# EAGLE design BRAINCHIP (EAGLE 6.5.0)
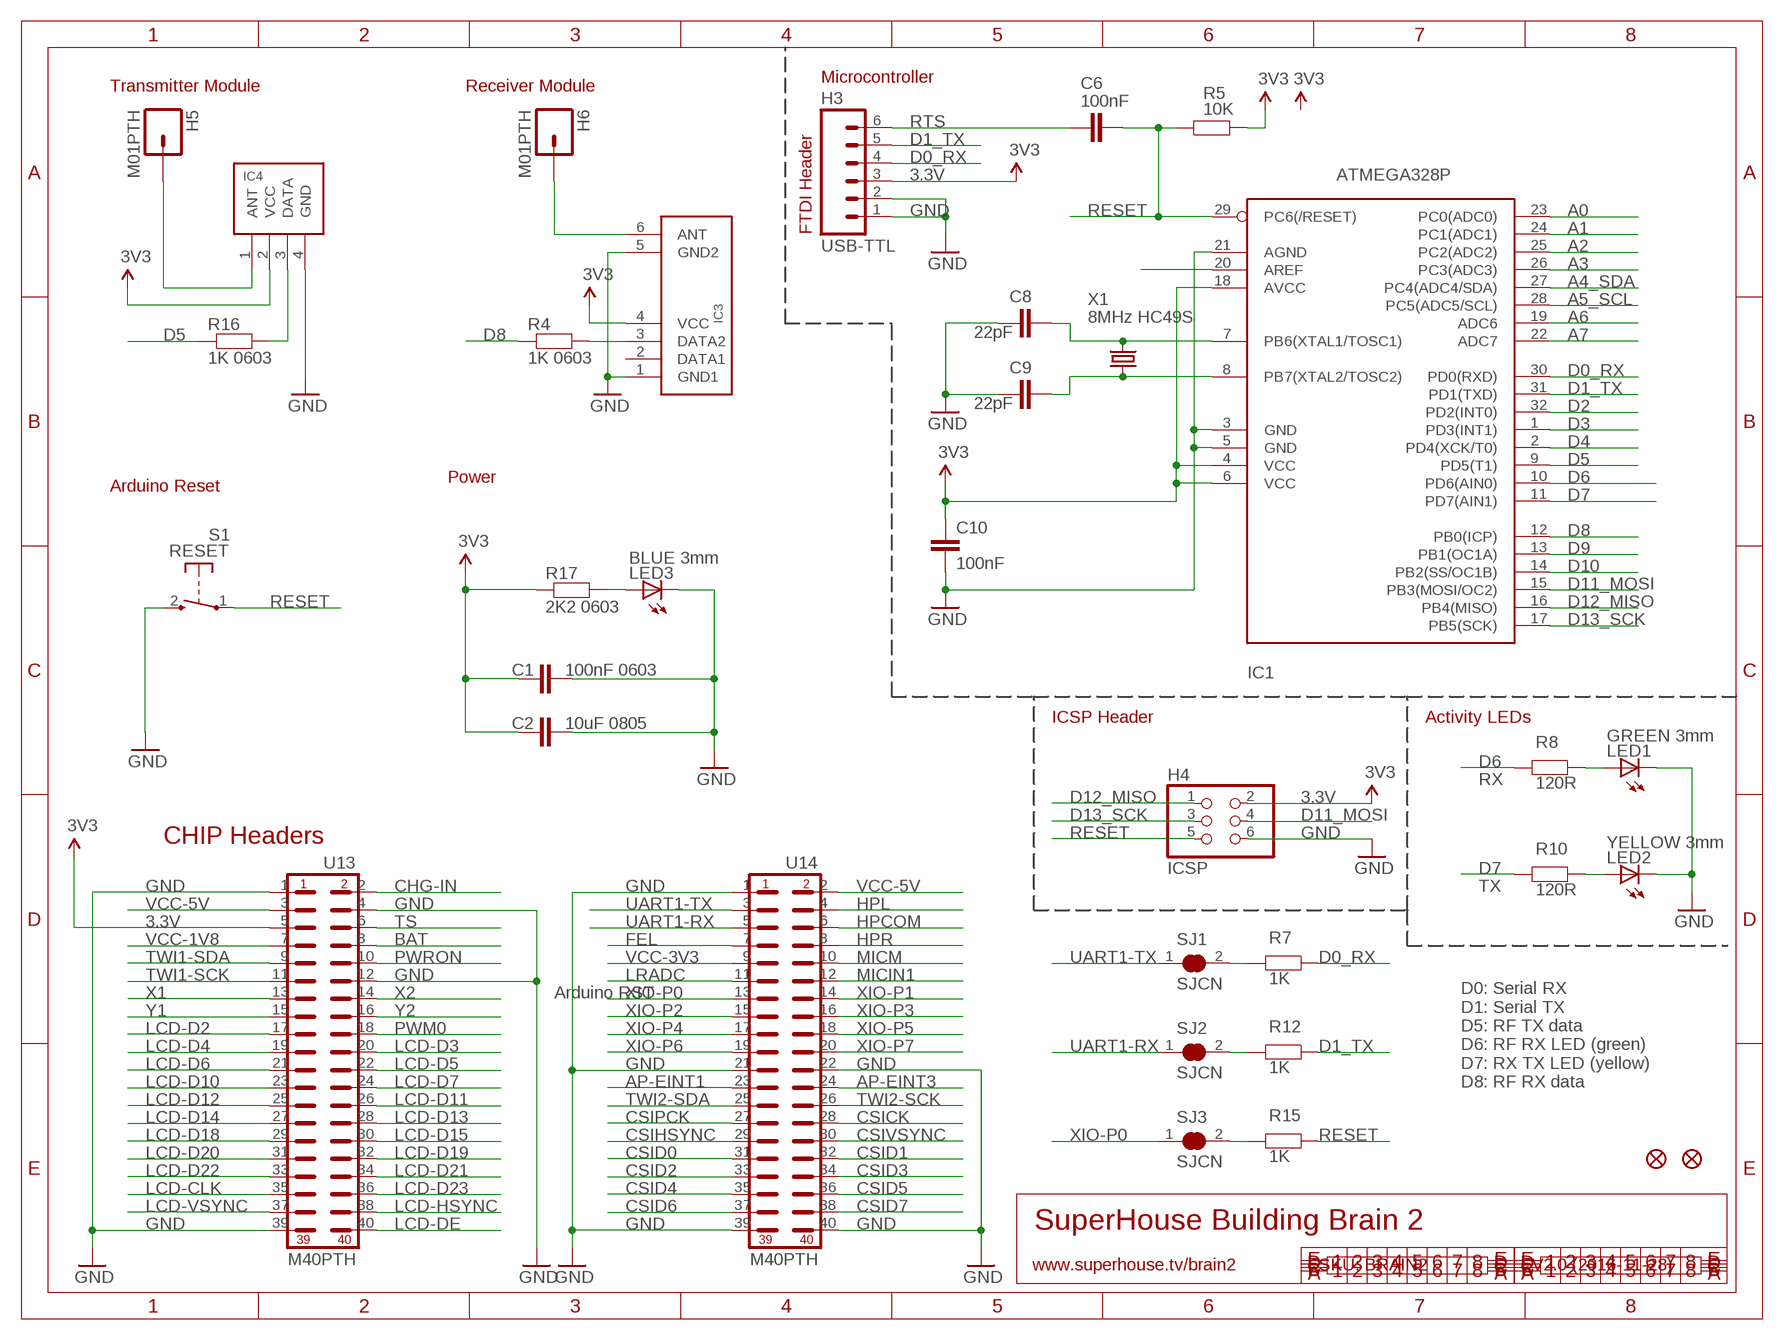
[diagram p0: schematic, sheet 1]

## Parts
C1  100nF 0603  CAP0603  [0603]
C2  10uF 0805  C-EUC0805  [C0805]
C6  100nF  CAP0603  [0603]
C8  22pF  CAP0603  [0603]
C9  22pF  CAP0603  [0603]
C10  100nF  CAP0603  [0603]
H3  USB-TTL  M06SIP  [1X06]
H4  ICSP  PINHD-2X3  [2X03]
H5  M01PTH  [1X01]
H6  M01PTH  [1X01]
IC1  ATMEGA328P  AVR-MEGA8-AI  [TQFP32-08]
IC3  RXB1  RXB1SHORTFLAT  [RX-B1-SHORT-FLAT]
IC4  TX-C1FLAT  [TX-C1-FLAT]
LED1  GREEN 3mm  LED3MM  [LED3MM]
LED2  YELLOW 3mm  LED3MM  [LED3MM]
LED3  BLUE 3mm  LED3MM  [LED3MM]
R4  1K 0603  RESISTOR0603  [0603]
R5  10K  RESISTOR0603  [0603]
R7  1K  RESISTOR0603  [0603]
R8  120R  RESISTOR0603  [0603]
R10  120R  RESISTOR0603  [0603]
R12  1K  RESISTOR0603  [0603]
R15  1K  RESISTOR0603  [0603]
R16  1K 0603  RESISTOR0603  [0603]
R17  2K2 0603  RESISTOR0603  [0603]
S1  RESET  TAC_SWITCH_2PIN  [TACTILE_SWITCH_SMD_2PIN_TINY]
SJ1  SJCN  [SJC]
SJ2  SJCN  [SJC]
SJ3  SJCN  [SJC]
U13  M40PTH  [2X20]
U14  M40PTH  [2X20]
U$5  FIDUCIAL1X2.5  [FIDUCIAL-1X2.5]
U$6  FIDUCIAL1X2.5  [FIDUCIAL-1X2.5]
X1  8MHz HC49S  CRYSTALHC49UV  [HC49U-V]

## Nets
3.3V: C1.1 C2.2 C10.1 H3.3 H4.2 IC1.4(VCC) IC1.6(VCC) IC1.18(AVCC) IC3.4(VCC) IC4.2(VCC) R5.2 R17.1 U13.5 ; supply symbol labelled 3V3
A0: IC1.23(PC0(ADC0))
A1: IC1.24(PC1(ADC1))
A2: IC1.25(PC2(ADC2))
A3: IC1.26(PC3(ADC3))
A4_SDA: IC1.27(PC4(ADC4/SDA))
A5_SCL: IC1.28(PC5(ADC5/SCL))
A6: IC1.19(ADC6)
A7: IC1.22(ADC7)
AP-EINT1: U14.23
AP-EINT3: U14.24
AREF: IC1.20(AREF)
BAT: U13.8
CHG-IN: U13.2
CSICK: U14.28
CSID0: U14.31
CSID1: U14.32
CSID2: U14.33
CSID3: U14.34
CSID4: U14.35
CSID5: U14.36
CSID6: U14.37
CSID7: U14.38
CSIHSYNC: U14.29
CSIPCK: U14.27
CSIVSYNC: U14.30
D0_RX: H3.4 IC1.30(PD0(RXD)) R7.1
D1_TX: H3.5 IC1.31(PD1(TXD)) R12.1
D2: IC1.32(PD2(INT0))
D3: IC1.1(PD3(INT1))
D4: IC1.2(PD4(XCK/T0))
D5: IC1.9(PD5(T1)) R16.1
D6: IC1.10(PD6(AIN0)) R8.2
D7: IC1.11(PD7(AIN1)) R10.2
D8: IC1.12(PB0(ICP)) R4.1
D9: IC1.13(PB1(OC1A))
D10: IC1.14(PB2(SS/OC1B))
D11_MOSI: H4.4 IC1.15(PB3(MOSI/OC2))
D12_MISO: H4.1 IC1.16(PB4(MISO))
D13_SCK: H4.3 IC1.17(PB5(SCK))
FEL: U14.7
GND: C1.2 C2.1 C8.1 C9.1 C10.2 H3.1 H3.2 H4.6 IC1.3(GND) IC1.5(GND) IC1.21(AGND) IC3.1(GND1) IC3.5(GND2) IC4.4(GND) LED1.K(C) LED2.K(C) LED3.K(C) S1.2(S) U13.1 U13.4 U13.12 U13.39 U14.1 U14.21 U14.22 U14.39 U14.40
HPCOM: U14.6
HPL: U14.4
HPR: U14.8
LCD-CLK: U13.35
LCD-D2: U13.17
LCD-D3: U13.20
LCD-D4: U13.19
LCD-D5: U13.22
LCD-D6: U13.21
LCD-D7: U13.24
LCD-D10: U13.23
LCD-D11: U13.26
LCD-D12: U13.25
LCD-D13: U13.28
LCD-D14: U13.27
LCD-D15: U13.30
LCD-D18: U13.29
LCD-D19: U13.32
LCD-D20: U13.31
LCD-D21: U13.34
LCD-D22: U13.33
LCD-D23: U13.36
LCD-DE: U13.40
LCD-HSYNC: U13.38
LCD-VSYNC: U13.37
LRADC: U14.11
MICIN1: U14.12
MICM: U14.10
N$288: IC3.3(DATA2) R4.2
N$289: LED3.A R17.2
N$290: H6.1 IC3.6(ANT)
N$291: H5.1 IC4.1(ANT)
N$292: IC4.3(DATA) R16.2
N$293: C8.2 IC1.7(PB6(XTAL1/TOSC1)) X1.2
N$294: C9.2 IC1.8(PB7(XTAL2/TOSC2)) X1.1
N$295: LED1.A R8.1
N$296: LED2.A R10.1
N$297: R7.2 SJ1.2
N$298: R12.2 SJ2.2
N$299: R15.2 SJ3.2
PWM0: U13.18
PWRON: U13.10
RESET: C6.2 H4.5 IC1.29(PC6(/RESET)) R5.1 R15.1 S1.1(P)
RTS: C6.1 H3.6
TS: U13.6
TWI1-SCK: U13.11
TWI1-SDA: U13.9
TWI2-SCK: U14.26
TWI2-SDA: U14.25
UART1-RX: SJ2.1 U14.5
UART1-TX: SJ1.1 U14.3
VCC-1V8: U13.7
VCC-3V3: U14.9
VCC-5V: U13.3 U14.2
X1: U13.13
X2: U13.14
XIO-P0: SJ3.1 U14.13
XIO-P1: U14.14
XIO-P2: U14.15
XIO-P3: U14.16
XIO-P4: U14.17
XIO-P5: U14.18
XIO-P6: U14.19
XIO-P7: U14.20
Y1: U13.15
Y2: U13.16
Unconnected: IC3.2(DATA1)

## Notes on the sheet
- Microcontroller
- Transmitter Module | Receiver Module
- FTDI Header
- Power
- Arduino Reset
- ICSP Header | Activity LEDs
- RX
- CHIP Headers
- TX
- Arduino RST
- D0: Serial RX
  D1: Serial TX
  D5: RF TX data
  D6: RF RX LED (green)
  D7: RX TX LED (yellow)
  D8: RF RX data
- SuperHouse Building Brain 2
- www.superhouse.tv/brain2 | SKU: BRAIN2 | V2.0 (2016-11-28)

## Library data of the parts
C1 = freetronics:CAP: Capacitor Standard 0603 ceramic capacitor, and 0.1" leaded capacitor.
C2 = freetronics-jon:C-EU: CAPACITOR, European symbol
C6 C8-C10 = freetronics-master-v1.1:CAP: Capacitor Standard 0603 ceramic capacitor, and 0.1" leaded capacitor.
H3 = freetronics:M06: Header 6 Standard 6-pin 0.1" header. Use with straight break away headers (SKU : PRT-00116), right angle break away headers (PRT-00553), swiss pins (PRT-00743), machine pins (PRT-00117), and female headers (PRT-00115). Molex polarized connector foot print use with SKU : PRT-08094 with associated crimp pins and housings. NOTES ON THE VARIANTS LOCK and LOCK_LONGPADS... This footprint was designed to help hold the alignment of a through-hole component (i.e. 6-pin header) while soldering it into place. You may notice that each hole has been shifted either up or down by 0.005 of an inch from it's more standard position (which is a perfectly straight line). This slight alteration caused the pins (the squares in the middle) to touch the edges of the holes. Because they are alternating, it causes a "brace" to hold the component in place. 0.005 has proven to be the perfect amount of "off-center" position when using our standard breakaway headers. Although looks a little odd when you look at the bare footprint, once you have a header in there, the alteration is very hard to notice. Also, if you push a header all the way into place, it is covered up entirely on the bottom side. This idea of altering the position of holes to aid alignment will be further integrated into the Sparkfun Library for other footprints. It can help hold any component with 3 or more connection pins.
H4 = pinhead:PINHD-2X3: PIN HEADER
H5 H6 = freetronics:M01: Header 1 Standard 1-pin 0.1" header. Use with straight break away headers (SKU : PRT-00116), right angle break away headers (PRT-00553), swiss pins (PRT-00743), machine pins (PRT-00117), and female headers (PRT-00115).
IC1 = freetronics-master-v1.1:AVR-MEGA8: MICROCONTROLLER 8 Kbytes FLASH 1 kbytes SRAM 512 bytes EEPROM USART 6-channel 10 bit ADC 2-channel 8 bit ADC
IC3 = freetronics-master-v1:RXB1SHORT
IC4 = freetronics-jon:TX-C1
LED1-LED3 = freetronics-2:LED: LEDs Standard schematic elements and footprints for 5mm, 3mm, 1206, and 0603 sized LEDs. 5mm - Spark Fun Electronics SKU : COM-00529 (and others)
R4 R16 R17 = freetronics-jon:RESISTOR: Resistor Basic schematic elements and footprints for 0603, 1206, and PTH 1/10th watt (small) resistors.
R5 R7 R8 R10 R12 R15 = freetronics-master-v1.1:RESISTOR: Resistor Basic schematic elements and footprints for 0603, 1206, and PTH 1/10th watt (small) resistors.
S1 = freetronics-jon:TAC_SWITCH_2PIN: Momentary Tactile Switch - 2 pin
SJ1-SJ3 = freetronics-jon:SJC
U13 U14 = freetronics-jon:M40
U$5 U$6 = freetronics-original:FIDUCIAL: Fiducial Alignment Points Various fiducial points for machine vision alignment.
X1 = freetronics:CRYSTAL: Crystals Various standard crystals. Proven footprints. Spark Fun Electronics SKU : COM-00534

## Board
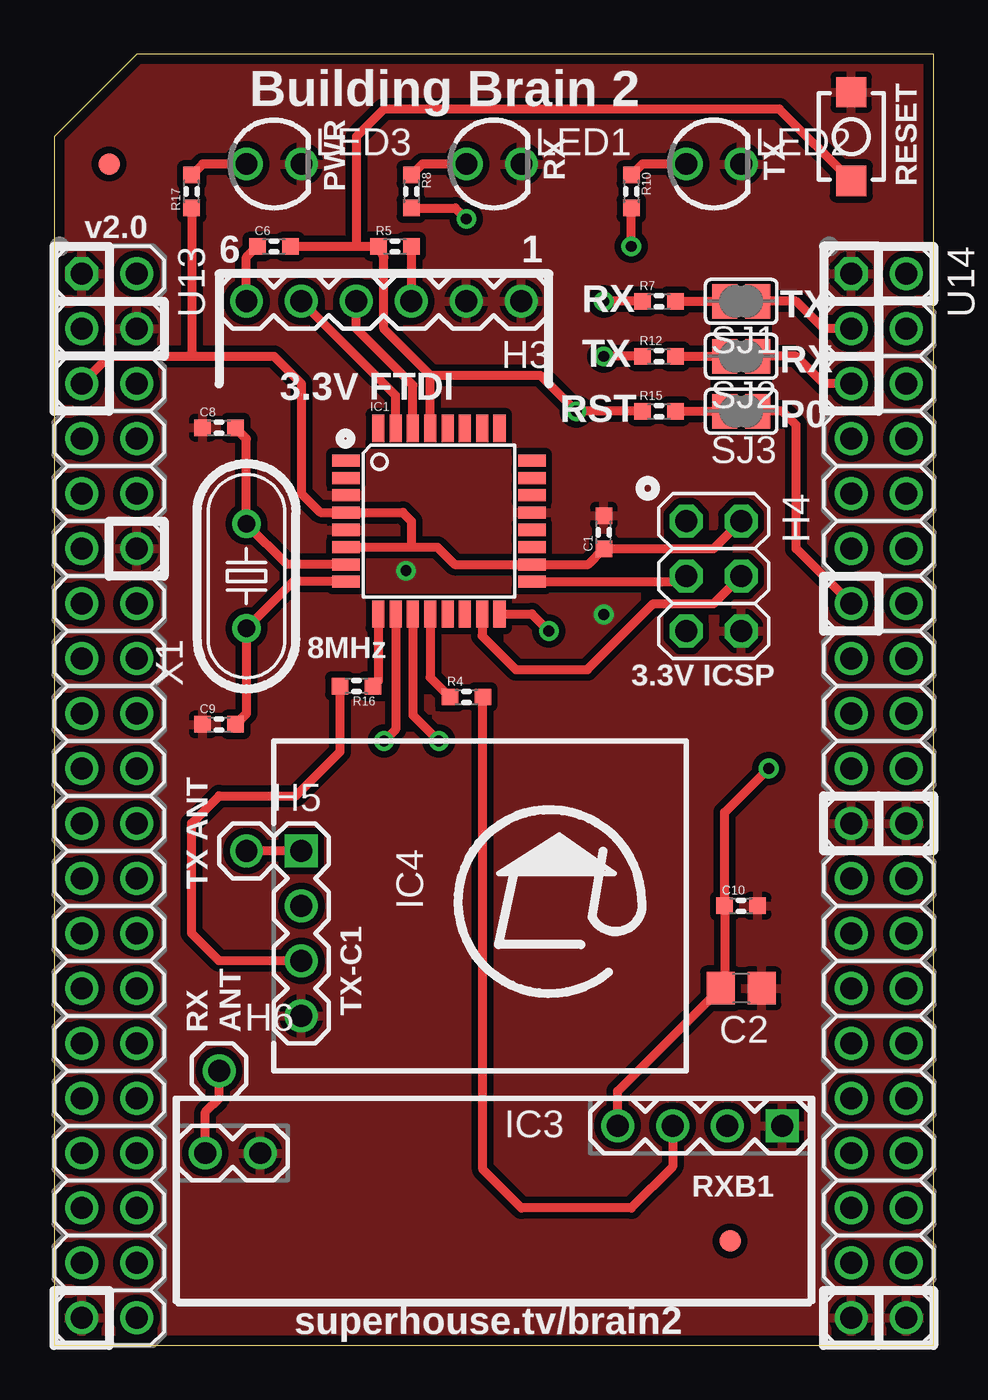
[diagram p1: board, top side]
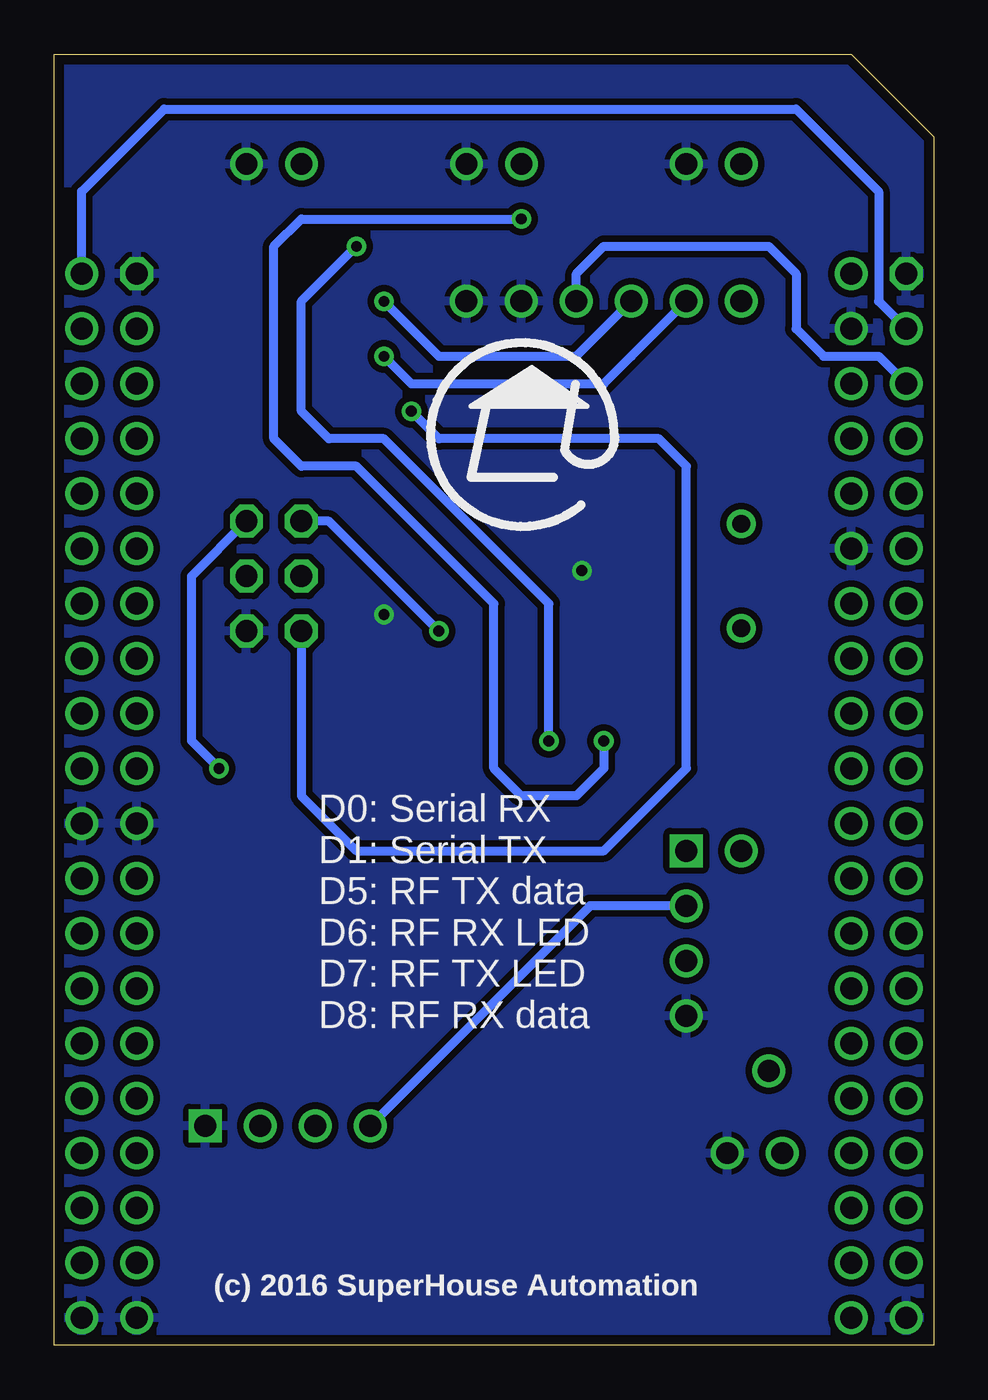
[diagram p2: board, bottom side, seen from below]

Size 40.64 x 59.69 mm. Coordinates in mm from the lower left corner, seen from the top.
Outline: 0,0 40.64,0 40.64,59.69 3.81,59.69 0,55.88 0,0
Copper layers (1*16): Top 0.035mm / dielectric 1.5mm / Bottom 0.035mm
Design rules "default *": minimum track width 10mil, minimum drill 24mil, track to track 12mil, track to pad 12mil, pad to pad 12mil, via to via 12mil, smd to smd 8mil, copper to edge 18mil, drill to drill 8mil, minimum pad ring 10mil, minimum via ring 8mil, stop-mask expansion 4mil, vias tented up to drill 0mil, thermal gap 10mil

### Footprints (pad centres in the part's own frame; a part is rotated, then mirrored left to right if it is on the bottom)
0603 = smd 0.762 x 0.762: 1 -0.762,0; 2 0.762,0
C0805 = smd 1.3 x 1.5: 1 -0.95,0; 2 0.95,0
1X06 = drill 1.016: 1 0,0; 2 2.54,0; 3 5.08,0; 4 7.62,0; 5 10.16,0; 6 12.7,0
2X03 = drill 1.016 octagon: 1 -2.54,-1.27; 2 -2.54,1.27; 3 0,-1.27; 4 0,1.27; 5 2.54,-1.27; 6 2.54,1.27
1X01 = drill 1.016: 1 0,0
TQFP32-08 = smd 1.27 x 0.559: 1 -4.293,2.8; 2 -4.293,2; 3 -4.293,1.2; 4 -4.293,0.4; 5 -4.293,-0.4; 6 -4.293,-1.2; 7 -4.293,-2; 8 -4.293,-2.8; 17 4.293,-2.8; 18 4.293,-2; 19 4.293,-1.2; 20 4.293,-0.4; 21 4.293,0.4; 22 4.293,1.2; 23 4.293,2; 24 4.293,2.8 | smd 0.559 x 1.27: 9 -2.8,-4.293; 10 -2,-4.293; 11 -1.2,-4.293; 12 -0.4,-4.293; 13 0.4,-4.293; 14 1.2,-4.293; 15 2,-4.293; 16 2.8,-4.293; 25 2.8,4.293; 26 2,4.293; 27 1.2,4.293; 28 0.4,4.293; 29 -0.4,4.293; 30 -1.2,4.293; 31 -2,4.293; 32 -2.8,4.293
RX-B1-SHORT-FLAT = drill 1.016 square: 1 0,0 | drill 1.016: 2 2.54,0; 3 5.08,0; 4 7.62,0; 5 24.13,1.27; 6 26.67,1.27
TX-C1-FLAT = drill 1.016 square: 1 0,0 | drill 1.016: 2 2.54,0; 3 5.08,0; 4 7.62,0
LED3MM = drill 1: A -1.27,0; K 1.27,0
TACTILE_SWITCH_SMD_2PIN_TINY = smd 1.4 x 1.4: 1 -2.05,0; 2 2.05,0
SJC = smd 1.168 x 1.6: 1 -0.762,0; 2 0.762,0
2X20 = drill 1.016 octagon: 1 0,0 | drill 1.016: 2 0,2.54; 3 2.54,0; 4 2.54,2.54; 5 5.08,0; 6 5.08,2.54; 7 7.62,0; 8 7.62,2.54; 9 10.16,0; 10 10.16,2.54; 11 12.7,0; 12 12.7,2.54; 13 15.24,0; 14 15.24,2.54; 15 17.78,0; 16 17.78,2.54; 17 20.32,0; 18 20.32,2.54; 19 22.86,0; 20 22.86,2.54; 21 25.4,0; 22 25.4,2.54; 23 27.94,0; 24 27.94,2.54; 25 30.48,0; 26 30.48,2.54; 27 33.02,0; 28 33.02,2.54; 29 35.56,0; 30 35.56,2.54; 31 38.1,0; 32 38.1,2.54; 33 40.64,0; 34 40.64,2.54; 35 43.18,0; 36 43.18,2.54; 37 45.72,0; 38 45.72,2.54; 39 48.26,0; 40 48.26,2.54
FIDUCIAL-1X2.5 = smd 1 x 1: 1 0,0
HC49U-V = drill 0.813: 1 -2.413,0; 2 2.413,0

### Placement (x,y rotation side)
C1  25.4,37.59 90 top
C2  31.75,16.51 180 top
C6  10.16,50.8 0 top
C8  7.62,42.42 0 top
C9  7.62,28.7 0 top
C10  31.75,20.32 0 top
H3  21.59,48.26 180 top
H4  30.48,35.56 270 top
H5  8.89,22.86 0 top
H6  7.62,12.7 0 top
IC1  17.78,38.1 0 top
IC3  33.66,10.16 180 top
IC4  11.43,22.86 270 top
LED1  20.32,54.61 0 top
LED2  30.48,54.61 0 top
LED3  10.16,54.61 0 top
R4  19.05,29.97 0 top
R5  15.75,50.8 0 top
R7  27.94,48.26 0 top
R8  16.51,53.34 270 top
R10  26.67,53.34 270 top
R12  27.94,45.72 0 top
R15  27.94,43.18 0 top
R16  13.97,30.48 180 top
R17  6.35,53.34 90 top
S1  36.83,55.88 90 top
SJ1  31.75,48.26 180 top
SJ2  31.75,45.72 180 top
SJ3  31.75,43.18 180 top
U13  1.27,49.53 270 top
U14  36.83,49.53 270 top
U$5  31.24,4.83 0 top
U$6  2.54,54.61 0 top
X1  8.89,35.56 90 top

### Tracks (layer width: path | path; a pad name or v marks a point on that pad's centre or on a via)
3.3V  (via drill 0.5)
  Top 0.406: IC3.4 26.04,11.74 C2.2 30.99,16.7 C10.1 30.99,24.64 v33.02,26.67 | IC1.6 16.51,36.9 | 16.51,36.9 17.71,36.9 18.51,36.1 IC1.18 24.67,36.1 C1.1 30.48,36.83 H4.2 | 16.51,36.9 16.51,38.1 16.11,38.5 IC1.4 12.3,38.5 11.43,39.37 11.43,44.45 10.16,45.72 6.35,45.72 | R17.1 6.35,45.72 | U13.5 2.54,45.72 6.35,45.72 | R5.2 H3.3
  Bottom 0.406: v33.02,26.67 34.29,27.94 34.29,35.56 H4.2 | H3.3 16.51,49.53 15.24,50.8 7.62,50.8 6.35,49.53 6.35,46.99 5.08,45.72 2.54,45.72 U13.5 | IC4.2 15.88,20.32 IC3.4
D0_RX  (via drill 0.5)
  Top 0.406: IC1.30 16.58,44.38 13.97,46.99 H3.4 | R7.1 v25.4,48.26
  Bottom 0.406: v25.4,48.26 22.86,45.72 16.51,45.72 H3.4
D1_TX  (via drill 0.5)
  Top 0.406: IC1.31 15.78,43.91 H3.5 | R12.1 v25.4,45.72
  Bottom 0.406: 13.97,45.72 H3.5 15.24,44.45 24.13,44.45 v25.4,45.72
D5
  Top 0.406: IC1.9 14.98,30.73 R16.1
D6  (via drill 0.5)
  Top 0.406: IC1.10 15.78,28.48 v15.24,27.94 | R8.2 18.54,52.58 v19.05,52.07
  Bottom 0.406: v15.24,27.94 15.24,26.67 16.51,25.4 19.05,25.4 20.32,26.67 20.32,34.29 26.67,40.64 29.21,40.64 30.48,41.91 30.48,50.8 29.21,52.07 v19.05,52.07
D7  (via drill 0.5)
  Top 0.406: IC1.11 16.58,29.14 v17.78,27.94 | v26.67,50.8 R10.2
  Bottom 0.406: v17.78,27.94 17.78,34.29 25.4,41.91 27.94,41.91 29.21,43.18 29.21,48.26 v26.67,50.8
D8
  Top 0.406: IC1.12 17.38,30.88 R4.1
D11_MOSI
  Top 0.406: IC1.15 19.78,32.8 21.34,31.24 24.64,31.24 27.69,34.29 30.48,34.29 H4.4
D12_MISO  (via drill 0.5)
  Top 0.406: IC1.16 22.07,33.81 v22.86,33.02
  Bottom 0.406: v22.86,33.02 27.94,38.1 H4.1
D13_SCK
  Top 0.406: IC1.17 28.95,35.3 H4.3
GND  (via drill 0.5)
  other vias: 16.26,35.81 25.4,33.78
  pour Bottom: 0,55.88 3.81,59.69 40.64,59.69 40.64,0 0,0
  pour Top: 0,55.88 3.81,59.69 40.64,59.69 40.64,0 0,0
N$288
  Top 0.406: IC3.3 28.57,8.26 26.67,6.35 21.59,6.35 19.81,8.13 R4.2
N$289
  Top 0.406: LED3.A 6.86,54.61 R17.2
N$290
  Top 0.406: IC3.6 6.99,10.79 7.62,11.43 H6.1
N$291
  Top 0.406: IC4.1 H5.1
N$292
  Top 0.406: R16.2 13.21,27.43 11.18,25.4 7.62,25.4 6.35,24.13 6.35,19.05 7.62,17.78 IC4.3
N$293
  Top 0.406: IC1.7 10.76,36.1 X1.2 8.89,41.91 C8.2
N$294
  Top 0.406: IC1.8 11.04,35.3 X1.1 8.89,29.21 C9.2
N$295
  Top 0.406: LED1.A 17.02,54.61 R8.1
N$296
  Top 0.406: LED2.A 27.18,54.61 R10.1
N$297
  Top 0.406: R7.2 SJ1.2
N$298
  Top 0.406: R12.2 SJ2.2
N$299
  Top 0.406: R15.2 SJ3.2
RESET  (via drill 0.5)
  Top 0.406: C6.2 13.97,50.8 | 13.97,50.8 R5.1 15.24,50.29 15.24,46.99 17.38,44.85 | IC1.29 17.38,44.85 | R15.1 v24.13,43.18 22.46,44.85 17.38,44.85 | S1.1 33.51,57.15 15.24,57.15 13.97,55.88 13.97,50.8
  Bottom 0.406: H4.5 29.21,25.4 26.67,22.86 15.24,22.86 11.43,26.67 11.43,40.64 12.7,41.91 22.86,41.91 v24.13,43.18
RTS
  Top 0.406: H3.6 8.89,50.29 C6.1
UART1-RX
  Top 0.406: U14.5 35.56,44.45 34.29,45.72 SJ2.1
UART1-TX
  Top 0.406: U14.3 35.56,46.99 34.29,48.26 SJ1.1
VCC-5V
  Bottom 0.406: U14.2 39.37,53.34 35.56,57.15 6.35,57.15 2.54,53.34 2.54,48.26 U13.3
XIO-P0
  Top 0.406: U14.13 34.29,36.83 34.29,42.55 33.66,43.18 SJ3.1

### Text on the board
tPlace: Building Brain 2 | RX | TX | RESET | PWR | v2.0 | 6 | 1 | RX | TX | TX | RX | 3.3V FTDI | RST | P0 | 8MHz | 3.3V ICSP | TX ANT | TX-C1 | RX / ANT | RXB1 | superhouse.tv/brain2
bPlace: D0: Serial RX / D1: Serial TX / D5: RF TX data / D6: RF RX LED / D7: RF TX LED / D8: RF RX data | (c) 2016 SuperHouse Automation